# EAGLE design swbox_midi (EAGLE 6.3)

## Sheet 1 of 8
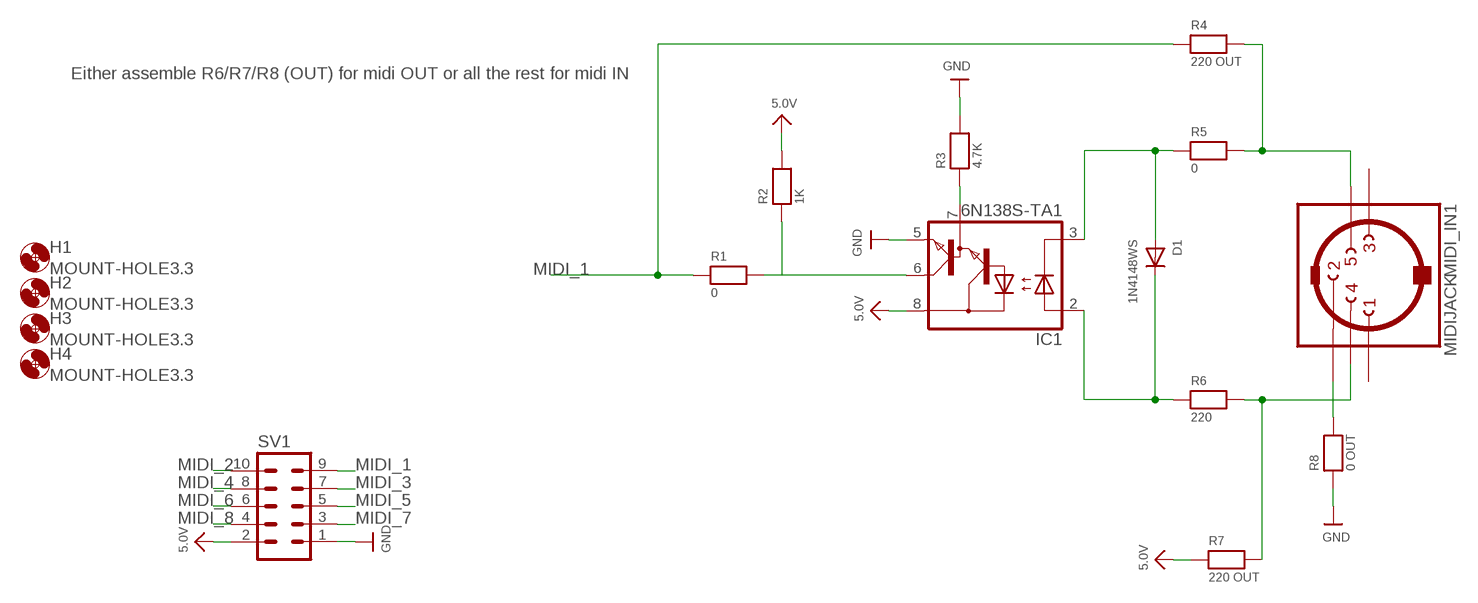
[diagram p0: schematic, sheet 1]

### Parts
D1  1N4148WS  DIODESOD-323  [SOD-323]
H1  MOUNT-HOLE3.3  [3,3]
H2  MOUNT-HOLE3.3  [3,3]
H3  MOUNT-HOLE3.3  [3,3]
H4  MOUNT-HOLE3.3  [3,3]
IC1  6N138S-TA1  6N138SMD  [SO8-GW300]
MIDI_IN1  MIDIJACK  [CP-2350]
R1  0  RESISTOR_0603  [_0603]
R2  1K  RESISTOR_0603  [_0603]
R3  4.7K  RESISTOR_0603  [_0603]
R4  220 OUT  RESISTOR_0603  [_0603]
R5  0  RESISTOR_0603  [_0603]
R6  220  RESISTOR_0603  [_0603]
R7  220 OUT  RESISTOR_0603  [_0603]
R8  0 OUT  RESISTOR_0603  [_0603]
SV1  ML10  [ML10]

### Nets
5.0V: IC1.8(VCC) R2.2 R7.1 SV1.2 ; also sheet 2,3,4,5,6,7,8
GND: IC1.5(GND) R3.2 R8.1 SV1.1 ; also sheet 2,3,4,5,6,7,8
MIDI_1: R1.1 R4.1 SV1.9
MIDI_2: SV1.10 ; also sheet 2
MIDI_3: SV1.7 ; also sheet 3
MIDI_4: SV1.8 ; also sheet 4
MIDI_5: SV1.5 ; also sheet 5
MIDI_6: SV1.6 ; also sheet 6
MIDI_7: SV1.3 ; also sheet 7
MIDI_8: SV1.4 ; also sheet 8
N$1: IC1.6(VO) R1.2 R2.1
N$3: MIDI_IN1.4 R6.2 R7.2
N$4: D1.C IC1.2(A) R6.1
N$5: D1.A IC1.3(C) R5.1
N$6: IC1.7(VB) R3.1
N$7: MIDI_IN1.5 R4.2 R5.2
N$8: MIDI_IN1.2 R8.2
Unconnected: MIDI_IN1.1 MIDI_IN1.3

### Notes on the sheet
- Either assemble R6/R7/R8 (OUT) for midi OUT or all the rest for midi IN

## Sheet 2 of 8
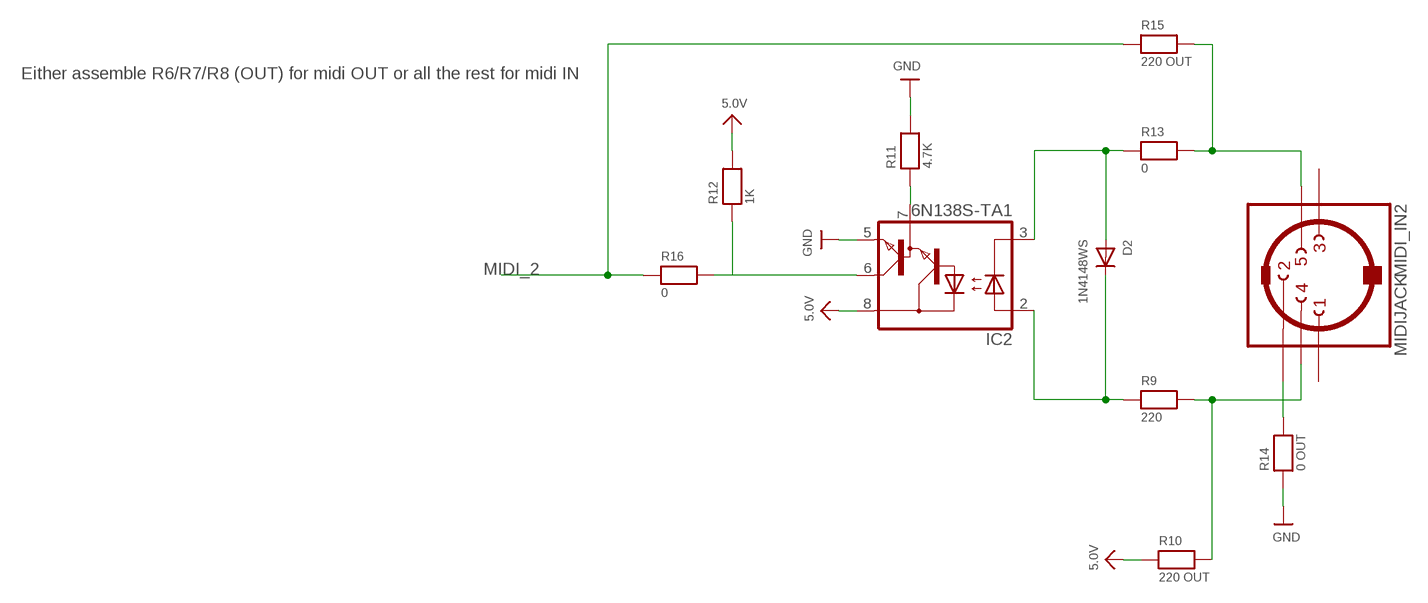
[diagram p1: schematic, sheet 2]

### Parts
D2  1N4148WS  DIODESOD-323  [SOD-323]
IC2  6N138S-TA1  6N138SMD  [SO8-GW300]
MIDI_IN2  MIDIJACK  [CP-2350]
R9  220  RESISTOR_0603  [_0603]
R10  220 OUT  RESISTOR_0603  [_0603]
R11  4.7K  RESISTOR_0603  [_0603]
R12  1K  RESISTOR_0603  [_0603]
R13  0  RESISTOR_0603  [_0603]
R14  0 OUT  RESISTOR_0603  [_0603]
R15  220 OUT  RESISTOR_0603  [_0603]
R16  0  RESISTOR_0603  [_0603]

### Nets
5.0V: IC2.8(VCC) R10.1 R12.2 ; also sheet 1,3,4,5,6,7,8
GND: IC2.5(GND) R11.2 R14.1 ; also sheet 1,3,4,5,6,7,8
MIDI_2: R15.1 R16.1 ; also sheet 1
N$2: MIDI_IN2.4 R9.2 R10.2
N$9: D2.C IC2.2(A) R9.1
N$10: D2.A IC2.3(C) R13.1
N$11: IC2.7(VB) R11.1
N$12: IC2.6(VO) R12.1 R16.2
N$13: MIDI_IN2.5 R13.2 R15.2
N$14: MIDI_IN2.2 R14.2
Unconnected: MIDI_IN2.1 MIDI_IN2.3

### Notes on the sheet
- Either assemble R6/R7/R8 (OUT) for midi OUT or all the rest for midi IN

## Sheet 3 of 8
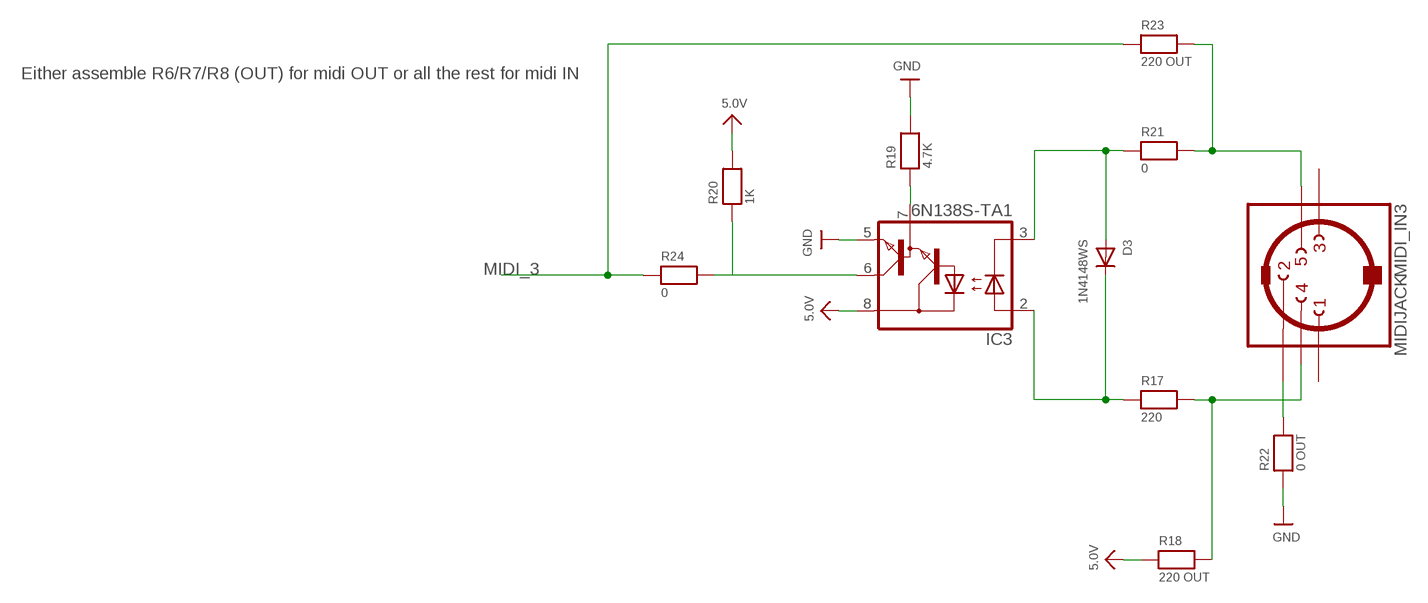
[diagram p2: schematic, sheet 3]

### Parts
D3  1N4148WS  DIODESOD-323  [SOD-323]
IC3  6N138S-TA1  6N138SMD  [SO8-GW300]
MIDI_IN3  MIDIJACK  [CP-2350]
R17  220  RESISTOR_0603  [_0603]
R18  220 OUT  RESISTOR_0603  [_0603]
R19  4.7K  RESISTOR_0603  [_0603]
R20  1K  RESISTOR_0603  [_0603]
R21  0  RESISTOR_0603  [_0603]
R22  0 OUT  RESISTOR_0603  [_0603]
R23  220 OUT  RESISTOR_0603  [_0603]
R24  0  RESISTOR_0603  [_0603]

### Nets
5.0V: IC3.8(VCC) R18.1 R20.2 ; also sheet 1,2,4,5,6,7,8
GND: IC3.5(GND) R19.2 R22.1 ; also sheet 1,2,4,5,6,7,8
MIDI_3: R23.1 R24.1 ; also sheet 1
N$15: MIDI_IN3.4 R17.2 R18.2
N$16: D3.C IC3.2(A) R17.1
N$17: D3.A IC3.3(C) R21.1
N$18: IC3.7(VB) R19.1
N$19: IC3.6(VO) R20.1 R24.2
N$20: MIDI_IN3.5 R21.2 R23.2
N$21: MIDI_IN3.2 R22.2
Unconnected: MIDI_IN3.1 MIDI_IN3.3

### Notes on the sheet
- Either assemble R6/R7/R8 (OUT) for midi OUT or all the rest for midi IN

## Sheet 4 of 8
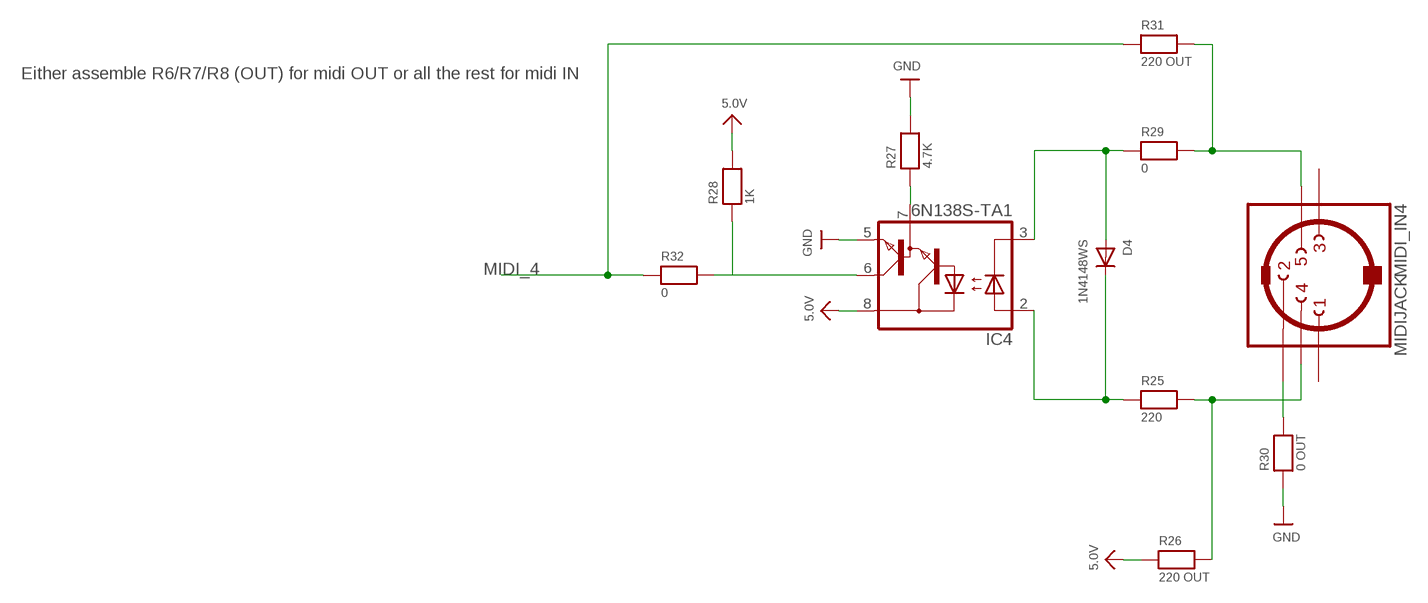
[diagram p3: schematic, sheet 4]

### Parts
D4  1N4148WS  DIODESOD-323  [SOD-323]
IC4  6N138S-TA1  6N138SMD  [SO8-GW300]
MIDI_IN4  MIDIJACK  [CP-2350]
R25  220  RESISTOR_0603  [_0603]
R26  220 OUT  RESISTOR_0603  [_0603]
R27  4.7K  RESISTOR_0603  [_0603]
R28  1K  RESISTOR_0603  [_0603]
R29  0  RESISTOR_0603  [_0603]
R30  0 OUT  RESISTOR_0603  [_0603]
R31  220 OUT  RESISTOR_0603  [_0603]
R32  0  RESISTOR_0603  [_0603]

### Nets
5.0V: IC4.8(VCC) R26.1 R28.2 ; also sheet 1,2,3,5,6,7,8
GND: IC4.5(GND) R27.2 R30.1 ; also sheet 1,2,3,5,6,7,8
MIDI_4: R31.1 R32.1 ; also sheet 1
N$22: MIDI_IN4.4 R25.2 R26.2
N$23: D4.C IC4.2(A) R25.1
N$24: D4.A IC4.3(C) R29.1
N$25: IC4.7(VB) R27.1
N$26: IC4.6(VO) R28.1 R32.2
N$27: MIDI_IN4.5 R29.2 R31.2
N$28: MIDI_IN4.2 R30.2
Unconnected: MIDI_IN4.1 MIDI_IN4.3

### Notes on the sheet
- Either assemble R6/R7/R8 (OUT) for midi OUT or all the rest for midi IN

## Sheet 5 of 8
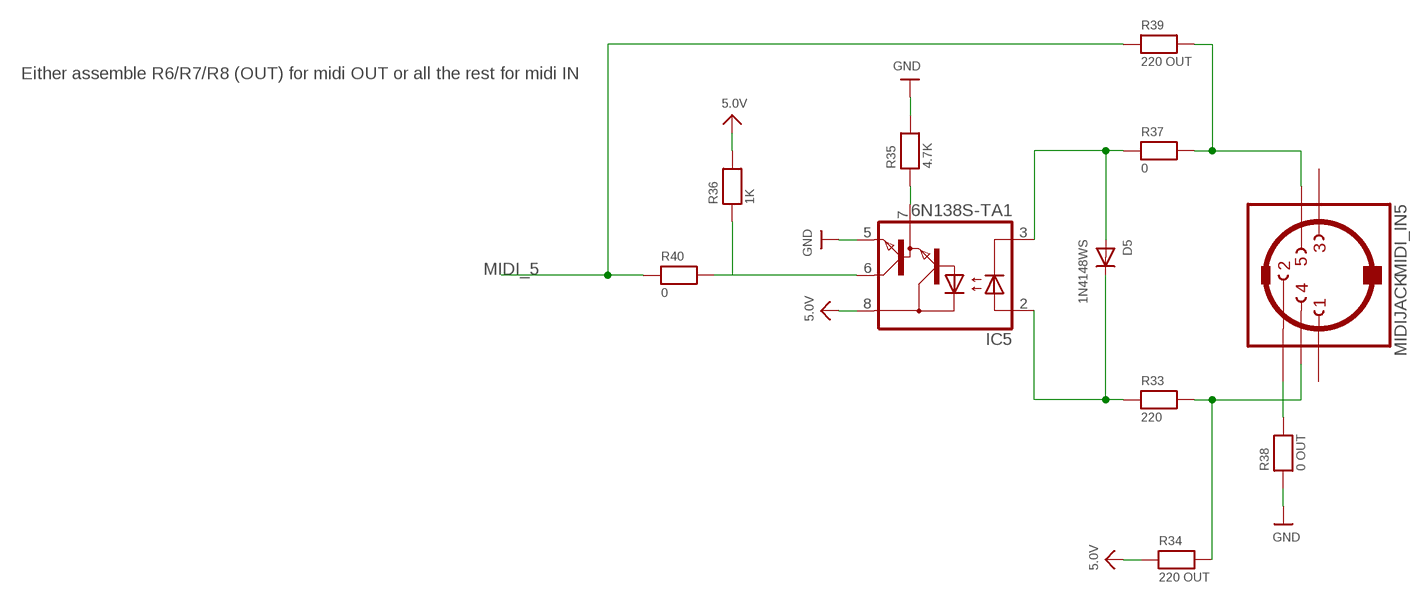
[diagram p4: schematic, sheet 5]

### Parts
D5  1N4148WS  DIODESOD-323  [SOD-323]
IC5  6N138S-TA1  6N138SMD  [SO8-GW300]
MIDI_IN5  MIDIJACK  [CP-2350]
R33  220  RESISTOR_0603  [_0603]
R34  220 OUT  RESISTOR_0603  [_0603]
R35  4.7K  RESISTOR_0603  [_0603]
R36  1K  RESISTOR_0603  [_0603]
R37  0  RESISTOR_0603  [_0603]
R38  0 OUT  RESISTOR_0603  [_0603]
R39  220 OUT  RESISTOR_0603  [_0603]
R40  0  RESISTOR_0603  [_0603]

### Nets
5.0V: IC5.8(VCC) R34.1 R36.2 ; also sheet 1,2,3,4,6,7,8
GND: IC5.5(GND) R35.2 R38.1 ; also sheet 1,2,3,4,6,7,8
MIDI_5: R39.1 R40.1 ; also sheet 1
N$29: MIDI_IN5.4 R33.2 R34.2
N$30: D5.C IC5.2(A) R33.1
N$31: D5.A IC5.3(C) R37.1
N$32: IC5.7(VB) R35.1
N$33: IC5.6(VO) R36.1 R40.2
N$34: MIDI_IN5.5 R37.2 R39.2
N$35: MIDI_IN5.2 R38.2
Unconnected: MIDI_IN5.1 MIDI_IN5.3

### Notes on the sheet
- Either assemble R6/R7/R8 (OUT) for midi OUT or all the rest for midi IN

## Sheet 6 of 8
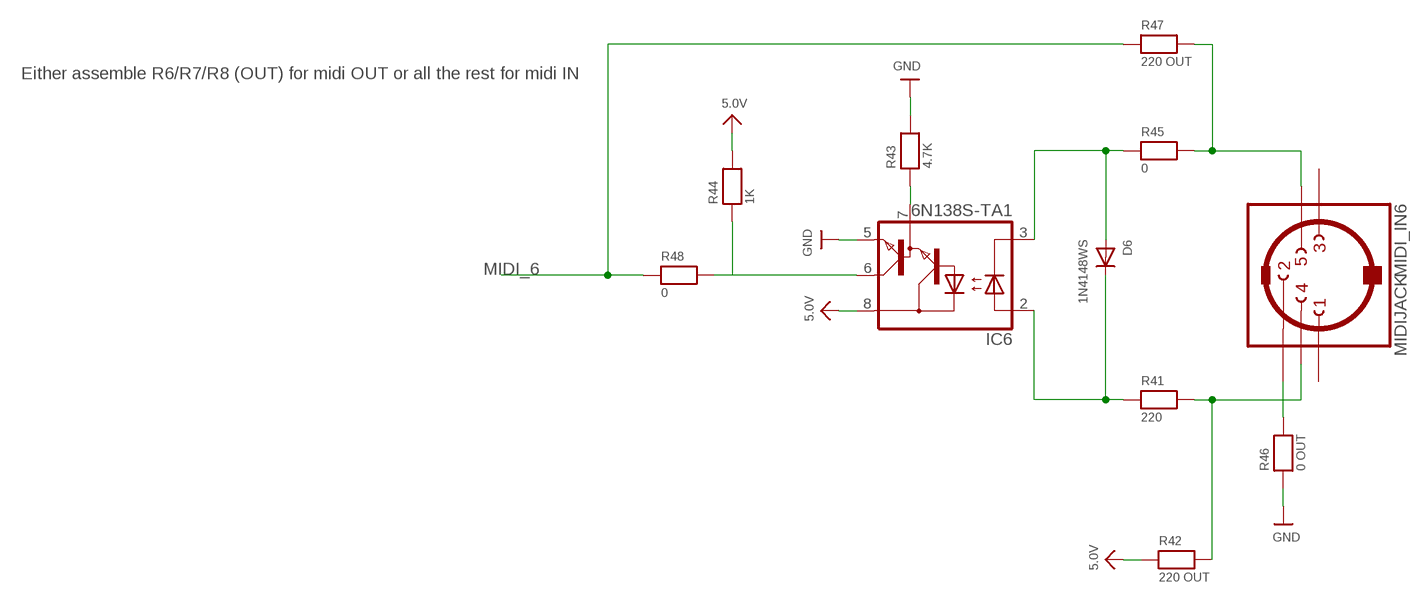
[diagram p5: schematic, sheet 6]

### Parts
D6  1N4148WS  DIODESOD-323  [SOD-323]
IC6  6N138S-TA1  6N138SMD  [SO8-GW300]
MIDI_IN6  MIDIJACK  [CP-2350]
R41  220  RESISTOR_0603  [_0603]
R42  220 OUT  RESISTOR_0603  [_0603]
R43  4.7K  RESISTOR_0603  [_0603]
R44  1K  RESISTOR_0603  [_0603]
R45  0  RESISTOR_0603  [_0603]
R46  0 OUT  RESISTOR_0603  [_0603]
R47  220 OUT  RESISTOR_0603  [_0603]
R48  0  RESISTOR_0603  [_0603]

### Nets
5.0V: IC6.8(VCC) R42.1 R44.2 ; also sheet 1,2,3,4,5,7,8
GND: IC6.5(GND) R43.2 R46.1 ; also sheet 1,2,3,4,5,7,8
MIDI_6: R47.1 R48.1 ; also sheet 1
N$36: MIDI_IN6.4 R41.2 R42.2
N$37: D6.C IC6.2(A) R41.1
N$38: D6.A IC6.3(C) R45.1
N$39: IC6.7(VB) R43.1
N$40: IC6.6(VO) R44.1 R48.2
N$41: MIDI_IN6.5 R45.2 R47.2
N$42: MIDI_IN6.2 R46.2
Unconnected: MIDI_IN6.1 MIDI_IN6.3

### Notes on the sheet
- Either assemble R6/R7/R8 (OUT) for midi OUT or all the rest for midi IN

## Sheet 7 of 8
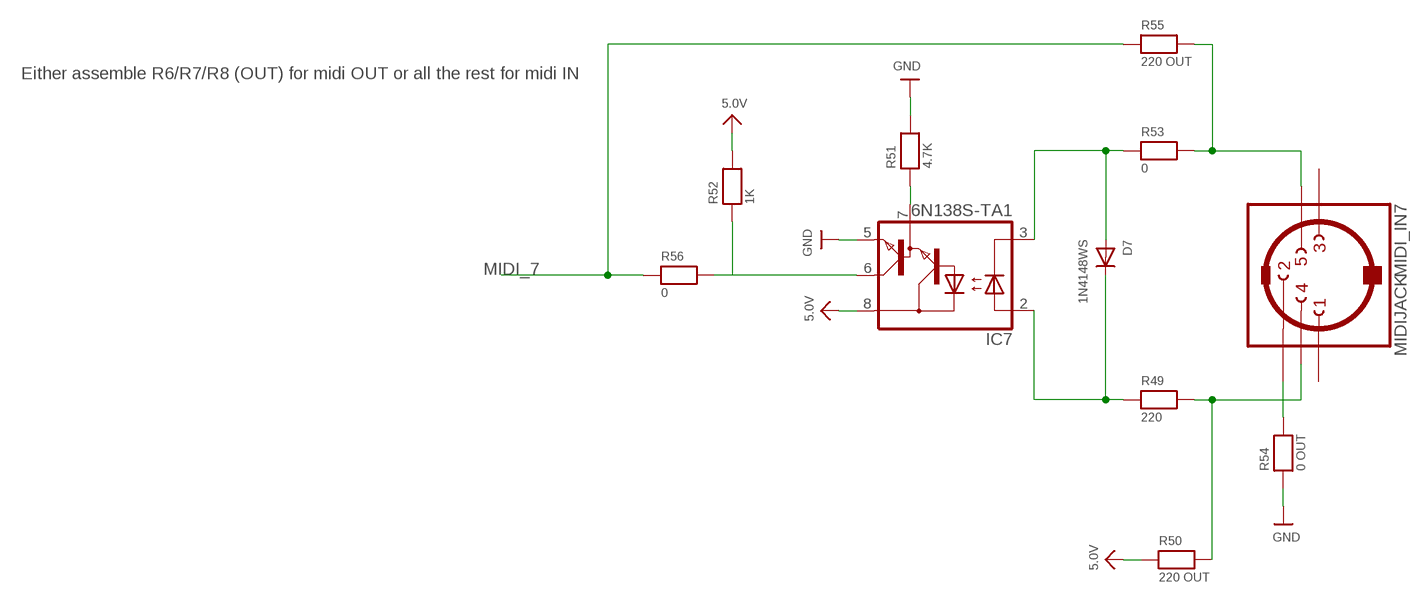
[diagram p6: schematic, sheet 7]

### Parts
D7  1N4148WS  DIODESOD-323  [SOD-323]
IC7  6N138S-TA1  6N138SMD  [SO8-GW300]
MIDI_IN7  MIDIJACK  [CP-2350]
R49  220  RESISTOR_0603  [_0603]
R50  220 OUT  RESISTOR_0603  [_0603]
R51  4.7K  RESISTOR_0603  [_0603]
R52  1K  RESISTOR_0603  [_0603]
R53  0  RESISTOR_0603  [_0603]
R54  0 OUT  RESISTOR_0603  [_0603]
R55  220 OUT  RESISTOR_0603  [_0603]
R56  0  RESISTOR_0603  [_0603]

### Nets
5.0V: IC7.8(VCC) R50.1 R52.2 ; also sheet 1,2,3,4,5,6,8
GND: IC7.5(GND) R51.2 R54.1 ; also sheet 1,2,3,4,5,6,8
MIDI_7: R55.1 R56.1 ; also sheet 1
N$43: MIDI_IN7.4 R49.2 R50.2
N$44: D7.C IC7.2(A) R49.1
N$45: D7.A IC7.3(C) R53.1
N$46: IC7.7(VB) R51.1
N$47: IC7.6(VO) R52.1 R56.2
N$48: MIDI_IN7.5 R53.2 R55.2
N$49: MIDI_IN7.2 R54.2
Unconnected: MIDI_IN7.1 MIDI_IN7.3

### Notes on the sheet
- Either assemble R6/R7/R8 (OUT) for midi OUT or all the rest for midi IN

## Sheet 8 of 8
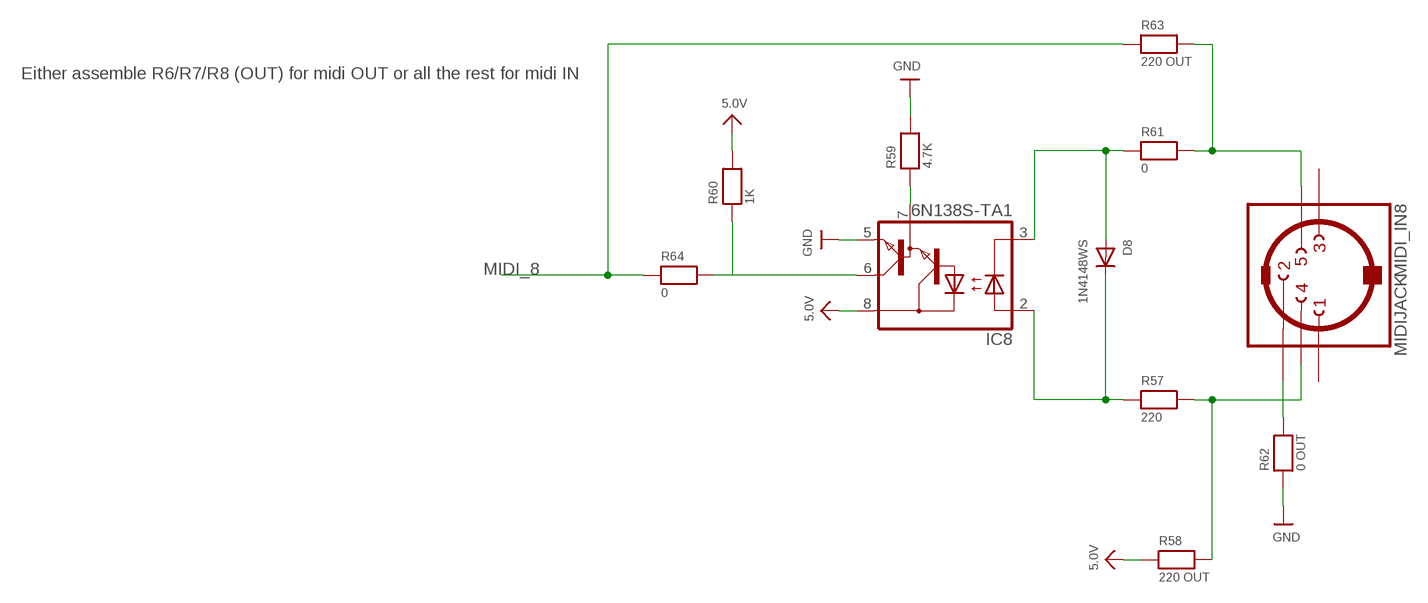
[diagram p7: schematic, sheet 8]

### Parts
D8  1N4148WS  DIODESOD-323  [SOD-323]
IC8  6N138S-TA1  6N138SMD  [SO8-GW300]
MIDI_IN8  MIDIJACK  [CP-2350]
R57  220  RESISTOR_0603  [_0603]
R58  220 OUT  RESISTOR_0603  [_0603]
R59  4.7K  RESISTOR_0603  [_0603]
R60  1K  RESISTOR_0603  [_0603]
R61  0  RESISTOR_0603  [_0603]
R62  0 OUT  RESISTOR_0603  [_0603]
R63  220 OUT  RESISTOR_0603  [_0603]
R64  0  RESISTOR_0603  [_0603]

### Nets
5.0V: IC8.8(VCC) R58.1 R60.2 ; also sheet 1,2,3,4,5,6,7
GND: IC8.5(GND) R59.2 R62.1 ; also sheet 1,2,3,4,5,6,7
MIDI_8: R63.1 R64.1 ; also sheet 1
N$50: MIDI_IN8.4 R57.2 R58.2
N$51: D8.C IC8.2(A) R57.1
N$52: D8.A IC8.3(C) R61.1
N$53: IC8.7(VB) R59.1
N$54: IC8.6(VO) R60.1 R64.2
N$55: MIDI_IN8.5 R61.2 R63.2
N$56: MIDI_IN8.2 R62.2
Unconnected: MIDI_IN8.1 MIDI_IN8.3

### Notes on the sheet
- Either assemble R6/R7/R8 (OUT) for midi OUT or all the rest for midi IN

## Library data of the parts
D1-D8 = microbuilder:DIODE: Diode SMA Model Volts Amps Type Vf Vr Digikey # Notes SSA34-E3 40V 3A Schottky 480mV @ 3A 200uA @ 40V SSA34-E3/61TGITR-ND CDBA120-G 20V 1A Schottky 500mV @ 1A 500uA @ 20V 641-1014-6-ND REEL MBRA210 10V 2A Schottky 350mV @ 2A 700uA @ 10V MBRA210LT3 SOD-123 Model Volts Amps Type Vf Vr Order # Notes BAT54T1G 30V 200mA Schottky 800mV @ 200mA 2uA @ 25V BAT54T1GOSTR-ND B0530W 30V 500mA Schottky 430mV @ 500mA 130uA @ 30V B0530W-FDICT-ND REEL MBR120 1A 20V Schottky 340mV @ 1A MBR120VLSFT1GOSCT-ND SOD-323 Model Volts Amps Type Vf Vr Order # Notes PMEG2005EJ 20V 500mA Schottky 355mV @ 500mA 568-4110-1-ND ZLLS410 10V 570mA Schottky 380mV @ 570mA ZLLS410CT-ND 1N4148WS 75V 150mA Silicon/Simple 1V 1N4148WSFSCT-ND REEL SOD-523 Model Volts Amps Type Vf Vr Order # Notes BAT54XV2 30V 200mA Schottky 0.8V @ 100mA BAT54XV2CT-ND TB751S 30V 30mA Schottky RB751S-40TE61CT-ND SOT23-R/W (R = Solder Paste/Reflow Ovens, W = Hand-Soldering) Model Volts Amps Type Vf Vr Order # Notes BAT54FILM 40V 300mA Schottky 497-7162-1-ND
H1-H4 = holes:MOUNT-HOLE: MOUNTING HOLE with drill center marker
IC1-IC8 = 6n138:6N138: MOTOROLA OPTO COUPLER
MIDI_IN1-MIDI_IN8 = keves:MIDIJACK: DIN 5 jack also known as MIDI jack A modification of conn-hirshman:MAB5SH with two options for the grounding 'teeth'
R1-R64 = microbuilder:RESISTOR: Resistors 0402 - 0402 Surface Mount Package 22 Ohm 1% 1/16W [Digikey: 311-22.0LRTR-ND] 33 Ohm 5% 1/16W 1.0K 5% 1/16W 1.5K 5% 1/16W 2.0K 1% 1/16W 10.0K 1% 1/16W [Digikey: 311-10.0KLRTR-ND] 10.0K 5% 1/16W [Digikey: RMCF0402JT10K0TR-ND] 12.1K 1% 1/16W [Digikey: 311-22.0LRTR-ND] 100.0K 5% 1/16W 0603 - 0603 Surface Mount Package 0 Ohm 1/10 Watt 1% Resistor 15 Ohm 1/10 Watt 1% Resistor 33 Ohm 1/10 Watt 1% Resistor 49.9 Ohm 1/10 Watt 1% Resistor 100 Ohm 1/10 Watt 1% Resistor 150 Ohm 1/10 Watt 1% Resistor 240 Ohm 1/10 Watt 1% Resistor 390 Ohm 1/10 Watt 1% Resistor 560 Ohm 1/10 Watt 1% Resistor 680 Ohm 1/10 Watt 1% Resistor 750 Ohm 1/10 Watt 1% Resistor 1.0K Ohm 1/10 Watt 1% Resistor 1.5K Ohm 1/10 Watt 1% Resistor 2.0K Ohm 1/10 Watt 1% Resistor 2.2K Ohm 1/10 Watt 1% Resistor 3.3K Ohm 1/10 Watt 1% Resistor 4.7K Ohm 1/10 Watt 1% Resistor 10.0K Ohm 1/10 Watt 1% Resistor 12.0K Ohm 1/10 Watt 1% Resistor 12.1K Ohm 1/10 Watt 1% Resistor 20.0K Ohm 1/10 Watt 1% Resistor 33.0K Ohm 1/10 Watt 1% Resistor 100.0K Ohm 1/10 Watt 1% Resistor 0805 - 0805 Surface Mount Package 0 Ohm 1/8 Watt 1% Resistor 33 Ohm 1/8 Watt 1% Resistor 100 Ohm 1/8 Watt 1% Resistor 150 Ohm 1/8 Watt 1% Resistor 200 Ohm 1/8 Watt 1% Resistor 240 Ohm 1/8 Watt 1% Resistor 330 Ohm 1/8 Watt 1% Resistor 390 Ohm 1/8 Watt 1% Resistor 470 Ohm 1/8 Watt 1% Resistor 1.0K Ohm 1/8 Watt 1% Resistor 1.5K Ohm 1/8 Watt 1% Resistor 2.0K Ohm 1/8 Watt 1% Resistor 4.7K Ohm 1/8 Watt 1% Resistor 5.1K Ohm 1/8 Watt 1% Resistor 5.6K Ohm 1/8 Watt 1% Resistor 10.0K Ohm 1/8 Watt 1% Resistor 22.0K Ohm 1/8 Watt 1% Resistor 33.0K Ohm 1/8 Watt 1% Resistor 100K Ohm 1/8 Watt 1% Resistor 1206 - 1206 Surface Mount Package 2012 - 2010 Surface Mount Package 0.11 Ohm 1/2 Watt 1% Resistor - Digikey: RHM.11UCT-ND
SV1 = con-harting-ml:ML10: HARTING; OC_FARNELL: unknown; OC_NEWARK: unknown

## Board
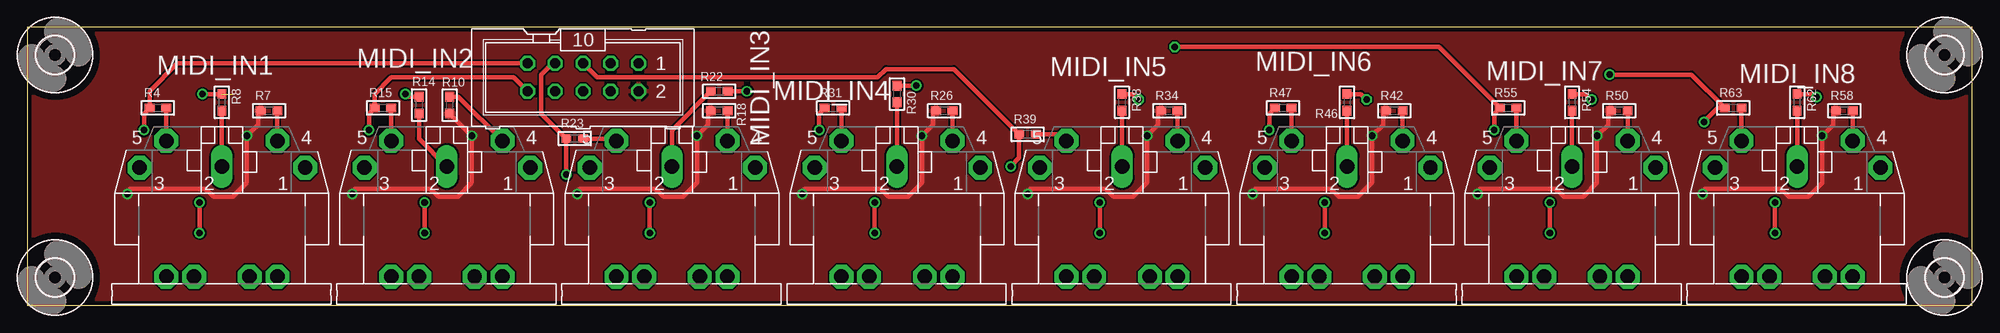
[diagram p8: board, top side]
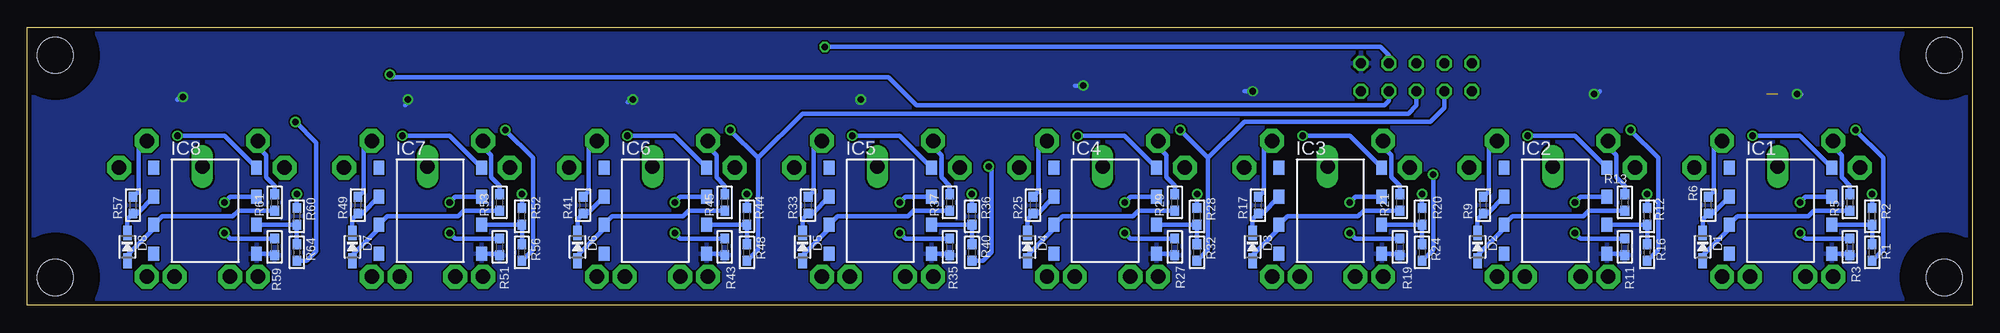
[diagram p9: board, bottom side, seen from below]

Size 177.8 x 25.4 mm. Coordinates in mm from the lower left corner, seen from the top.
Outline: 0,0 177.8,0 177.8,25.4 0,25.4 0,0
Copper layers (1*16): Top 0.0356mm / dielectric 1.5011mm / Bottom 0.0356mm
Design rules "oshpark_2layer *": minimum track width 6mil, minimum drill 13mil, track to track 6mil, track to pad 6mil, pad to pad 6mil, via to via 6mil, smd to smd 6mil, copper to edge 15mil, drill to drill 6mil, minimum pad ring 7mil, minimum via ring 7mil, stop-mask expansion 3mil, vias tented up to drill 0mil, thermal gap 10mil

### Footprints (pad centres in the part's own frame; a part is rotated, then mirrored left to right if it is on the bottom)
SOD-323 = smd 1.35 x 0.8: A 1.27,0; C -1.27,0
3,3 = hole 3.3: 0,0
SO8-GW300 = smd 1 x 1.27: 1 -4.69,3.937; 2 -4.69,1.27; 3 -4.69,-1.27; 4 -4.69,-3.937; 5 4.69,-3.937; 6 4.69,-1.27; 7 4.69,1.27; 8 4.69,3.937
CP-2350 = drill 1.321 pad 2.184 octagon: 1 7.62,12.58; 3 -7.52,12.58; 4 5.08,15.02; 5 -5.08,15.02; PE -2.54,2.62; PE1 -5.08,2.62; PE2 5.08,2.62; PE@ 2.54,2.62 | drill 1.321 long: 2 0,12.68
_0603 = smd 0.9 x 0.8: 1 -0.762,0; 2 0.762,0
ML10 = drill 0.914 octagon: 1 -5.08,-1.27; 2 -5.08,1.27; 3 -2.54,-1.27; 4 -2.54,1.27; 5 0,-1.27; 6 0,1.27; 7 2.54,-1.27; 8 2.54,1.27; 9 5.08,-1.27; 10 5.08,1.27

### Placement (x,y rotation side)
D1  24.64,5.33 270 bottom
D2  45.21,5.33 270 bottom
D3  65.79,5.33 270 bottom
D4  86.36,5.33 270 bottom
D5  106.93,5.33 270 bottom
D6  127.51,5.33 270 bottom
D7  148.08,5.33 270 bottom
D8  168.66,5.33 270 bottom
H1  2.54,2.54 0 top
H2  2.54,22.86 0 top
H3  175.26,2.54 0 top
H4  175.26,22.86 0 top
IC1  17.53,8.64 0 bottom
IC2  38.1,8.64 0 bottom
IC3  58.67,8.64 0 bottom
IC4  79.25,8.64 0 bottom
IC5  99.82,8.64 0 bottom
IC6  120.4,8.64 0 bottom
IC7  140.97,8.64 0 bottom
IC8  161.54,8.64 0 bottom
MIDI_IN1  17.78,0 0 top
MIDI_IN2  38.35,0 0 top
MIDI_IN3  58.93,0 0 top
MIDI_IN4  79.5,0 0 top
MIDI_IN5  100.08,0 0 top
MIDI_IN6  120.65,0 0 top
MIDI_IN7  141.22,0 0 top
MIDI_IN8  161.8,0 0 top
R1  9.14,4.83 90 bottom
R2  9.14,8.13 90 bottom
R3  11.18,5.33 270 bottom
R4  11.94,18.03 0 top
R5  11.18,9.4 90 bottom
R6  24.13,9.14 90 bottom
R7  22.1,17.78 0 top
R8  17.78,18.54 270 top
R9  44.7,9.14 90 bottom
R10  38.61,18.29 90 top
R11  31.75,5.33 270 bottom
R12  29.72,8.13 90 bottom
R13  31.75,9.4 90 bottom
R14  35.81,18.29 270 top
R15  32.51,18.03 0 top
R16  29.72,4.83 90 bottom
R17  65.28,9.14 90 bottom
R18  63.25,17.78 0 top
R19  52.32,5.33 270 bottom
R20  50.29,8.13 90 bottom
R21  52.32,9.4 90 bottom
R22  63.25,19.56 180 top
R23  50.04,15.24 0 top
R24  50.29,4.83 90 bottom
R25  85.85,9.14 90 bottom
R26  83.82,17.78 0 top
R27  72.9,5.33 270 bottom
R28  70.87,8.13 90 bottom
R29  72.9,9.4 90 bottom
R30  79.5,19.3 270 top
R31  73.66,18.03 0 top
R32  70.87,4.83 90 bottom
R33  106.43,9.14 90 bottom
R34  104.39,17.78 0 top
R35  93.47,5.33 270 bottom
R36  91.44,8.13 90 bottom
R37  93.47,9.4 90 bottom
R38  100.08,18.54 270 top
R39  91.44,15.62 0 top
R40  91.44,4.83 90 bottom
R41  127,9.14 90 bottom
R42  124.97,17.78 0 top
R43  114.05,5.33 270 bottom
R44  112.01,8.13 90 bottom
R45  114.05,9.4 90 bottom
R46  120.65,18.54 270 top
R47  114.81,18.03 0 top
R48  112.01,4.83 90 bottom
R49  147.57,9.14 90 bottom
R50  145.54,17.78 0 top
R51  134.62,5.33 270 bottom
R52  132.59,8.13 90 bottom
R53  134.62,9.4 90 bottom
R54  141.22,18.54 270 top
R55  135.38,18.03 0 top
R56  132.59,4.83 90 bottom
R57  168.15,9.14 90 bottom
R58  166.12,17.78 0 top
R59  155.19,5.33 270 bottom
R60  153.16,8.13 90 bottom
R61  155.19,9.4 90 bottom
R62  161.8,18.54 270 top
R63  155.96,18.03 0 top
R64  153.16,4.83 90 bottom
SV1  50.8,20.83 180 top

### Tracks (layer width: path | path; a pad name or v marks a point on that pad's centre or on a via)
5.0V  (via drill 0.6)
  Top 0.406: R7.1 21.08,17.78 21.08,16.51 v20.07,15.49 20.07,11.18 18.8,9.91 17.02,9.91 16.26,10.67 9.4,10.67 9.14,10.41 v9.14,10.16 | v29.72,10.16 29.72,10.41 29.97,10.67 36.83,10.67 37.59,9.91 39.37,9.91 40.64,11.18 v40.64,15.49 R10.1 | R18.1 62.23,17.78 62.23,16.51 v61.21,15.49 61.21,11.18 59.94,9.91 58.17,9.91 57.4,10.67 50.55,10.67 50.29,10.41 v50.29,10.16 | R26.1 82.8,17.78 82.8,16.51 v81.79,15.49 81.79,11.18 80.52,9.91 78.74,9.91 77.98,10.67 71.12,10.67 70.87,10.41 v70.87,10.16 | R34.1 103.38,17.78 103.38,16.51 v102.36,15.49 102.36,11.18 101.09,9.91 99.31,9.91 98.55,10.67 91.69,10.67 91.44,10.41 v91.44,10.16 | R42.1 123.95,17.78 123.95,16.51 v122.94,15.49 122.94,11.18 121.67,9.91 119.89,9.91 119.13,10.67 112.27,10.67 112.01,10.41 v112.01,10.16 | R50.1 144.53,17.78 144.53,16.51 v143.51,15.49 143.51,11.18 142.24,9.91 140.46,9.91 139.7,10.67 132.84,10.67 132.59,10.41 v132.59,10.16 | R58.1 165.1,17.78 165.1,16.51 v164.08,15.49 164.08,11.18 162.81,9.91 161.04,9.91 160.27,10.67 153.42,10.67 153.16,10.41 v153.16,10.16
  Bottom 0.406: v20.07,15.49 15.76,15.49 IC1.8 | R2.2 v9.14,10.16 | v40.64,15.49 36.33,15.49 IC2.8 | R12.2 v29.72,10.16 | v61.21,15.49 56.91,15.49 IC3.8 | R20.2 v50.29,10.16 | v81.79,15.49 77.48,15.49 IC4.8 | R28.2 v70.87,10.16 | v102.36,15.49 98.05,15.49 IC5.8 | R36.2 v91.44,10.16 | v122.94,15.49 118.63,15.49 IC6.8 | R44.2 v112.01,10.16 | v143.51,15.49 139.2,15.49 IC7.8 | R52.2 v132.59,10.16 | v164.08,15.49 159.78,15.49 IC8.8 | R60.2 v153.16,10.16
  pour Top: 0.51,0.51 0.51,24.89 177.29,24.89 177.29,0.51
GND  (via drill 0.6)  (1 unrouted)
  Top 0.406: R14.1 34.8,19.05 v34.54,19.3 | R22.1 v65.79,19.56 | R30.1 v81.28,20.07 | R38.1 101.09,19.3 v101.6,18.8 | R46.1 121.92,19.3 v122.43,18.8 | R54.1 142.49,19.3 v143,18.8 | R62.1 163.32,19.3 v163.58,19.05 | R8.1 v16,19.3
  Bottom 0.406: IC1.5 11.3,4.7 R3.2 | IC2.5 31.88,4.7 R11.2 | IC3.5 52.45,4.7 R19.2 | IC4.5 73.03,4.7 R27.2 | IC5.5 93.6,4.7 R35.2 | IC6.5 114.17,4.7 R43.2 | IC7.5 134.75,4.7 R51.2 | IC8.5 155.32,4.7 R59.2 | v16,19.3 15.62,19.3 | v34.54,19.3 34.29,19.3 34.04,19.56 | v65.79,19.56 66.55,19.56 | v81.28,20.07 82.04,20.07 | v101.6,18.8 101.85,18.54 | v122.43,18.8 122.68,18.8 122.94,18.54 | v143,18.8 143,18.54 143.26,18.29 | v163.58,19.05 163.83,19.05 164.08,18.8
  pour Bottom: 0.51,0.51 0.51,24.89 177.29,24.89 177.29,0.51
MIDI_1  (via drill 0.6)
  Top 0.406: v10.67,16 10.67,17.53 R4.1 11.18,19.56 13.72,22.1 SV1.9
  Bottom 0.406: R1.1 8.13,5.08 8.13,13.46 v10.67,16
MIDI_2  (via drill 0.6)
  Top 0.406: v31.24,16 31.24,17.53 R15.1 31.75,19.3 33.27,20.83 44.45,20.83 SV1.10
  Bottom 0.406: R16.1 28.7,5.08 28.7,13.46 v31.24,16
MIDI_3  (via drill 0.6)
  Top 0.406: v49.28,11.94 R23.1 46.99,17.53 46.99,21.08 48.01,22.1 SV1.7
  Bottom 0.406: R24.1 49.28,5.08 v49.28,11.94
MIDI_4  (via drill 0.6)
  Top 0.406: v72.39,16 72.39,17.53 R31.1
  Bottom 0.406: R32.1 69.85,5.08 69.85,13.46 | 69.85,13.46 v72.39,16 | 69.85,13.46 66.55,16.76 49.53,16.76 48.26,18.03 SV1.8
MIDI_5  (via drill 0.6)
  Top 0.406: SV1.5 52.07,20.83 77.72,20.83 78.49,21.59 84.71,21.59 R39.1 90.68,13.46 v89.92,12.7
  Bottom 0.406: R40.1 90.42,4.06 89.66,4.83 89.66,12.45 v89.92,12.7
MIDI_6  (via drill 0.6)
  Top 0.406: v113.54,16 113.54,17.53 R47.1
  Bottom 0.406: R48.1 111,5.08 111,13.46 | 111,13.46 v113.54,16 | SV1.6 50.8,18.29 51.56,17.53 106.93,17.53 111,13.46
MIDI_7  (via drill 0.6)
  Top 0.406: v134.11,16 134.11,17.53 R55.1 129.03,23.62 v104.9,23.62
  Bottom 0.406: R56.1 131.57,5.08 131.57,13.46 v134.11,16 | SV1.3 53.34,22.86 54.1,23.62 v104.9,23.62
MIDI_8  (via drill 0.6)
  Top 0.406: v144.65,21.08 152.15,21.08 R63.1 154.56,18.03 v153.29,16.76
  Bottom 0.406: SV1.4 53.34,18.67 53.72,18.29 96.52,18.29 99.06,20.83 144.4,20.83 v144.65,21.08 | R64.1 152.27,4.06 151.38,4.95 151.38,14.86 v153.29,16.76
N$1
  Bottom 0.406: R1.2 R2.1 IC1.6
N$2
  Top 0.406: R10.2 39.4,19.05 MIDI_IN2.4
  Bottom 0.406: R9.2 44.2,10.41 44.2,14.73 43.91,15.02 MIDI_IN2.4
N$3
  Top 0.406: MIDI_IN1.4 R7.2
  Bottom 0.406: R6.2 23.62,10.41 23.62,14.73 23.33,15.02 MIDI_IN1.4
N$4
  Bottom 0.406: IC1.2 23.74,8.38 R6.1 24.64,7.87 D1.C
N$5
  Bottom 0.406: R5.1 14.48,8.64 14.99,8.13 21.45,8.13 IC1.3 22.22,6.99 24.64,4.57 D1.A
N$6  (via drill 0.6)
  Top 0.406: v15.75,6.6 v15.75,9.4
  Bottom 0.406: R3.1 15.24,6.1 v15.75,6.6 | IC1.7 15.24,9.91 v15.75,9.4
N$7
  Top 0.406: MIDI_IN1.5 R4.2
  Bottom 0.406: R5.2 11.18,10.92 11.94,11.68 11.94,13.72 12.7,14.48 MIDI_IN1.5
N$8
  Top 0.406: R8.2 MIDI_IN1.2
N$9
  Bottom 0.406: IC2.2 44.31,8.38 R9.1 45.21,7.87 D2.C
N$10
  Bottom 0.406: R13.1 35.05,8.64 35.56,8.13 42.03,8.13 IC2.3 42.79,6.99 45.21,4.57 D2.A
N$11  (via drill 0.6)
  Top 0.406: v36.32,6.6 v36.32,9.4
  Bottom 0.406: R11.1 35.81,6.1 v36.32,6.6 | IC2.7 35.81,9.91 v36.32,9.4
N$12
  Bottom 0.406: R16.2 R12.1 IC2.6
N$13
  Top 0.406: MIDI_IN2.5 R15.2
  Bottom 0.406: R13.2 31.75,10.92 32.51,11.68 32.51,13.72 33.27,14.48 MIDI_IN2.5
N$14
  Top 0.406: R14.2 35.81,15.22 MIDI_IN2.2
N$15
  Top 0.406: MIDI_IN3.4 R18.2
  Bottom 0.406: R17.2 64.77,10.41 64.77,14.73 64.48,15.02 MIDI_IN3.4
N$16
  Bottom 0.406: IC3.2 64.89,8.38 R17.1 65.79,7.87 D3.C
N$17
  Bottom 0.406: R21.1 55.63,8.64 56.13,8.13 62.6,8.13 IC3.3 63.36,6.99 65.79,4.57 D3.A
N$18  (via drill 0.6)
  Top 0.406: v56.9,6.6 v56.9,9.4
  Bottom 0.406: R19.1 56.39,6.1 v56.9,6.6 | IC3.7 56.39,9.91 v56.9,9.4
N$19
  Bottom 0.406: R24.2 R20.1 IC3.6
N$20
  Top 0.406: R23.2 53.63,15.24 MIDI_IN3.5
  Bottom 0.406: R21.2 52.32,10.92 53.09,11.68 53.09,13.72 53.85,14.48 MIDI_IN3.5
N$21
  Top 0.406: MIDI_IN3.2 58.93,16 R22.2
N$22
  Top 0.406: MIDI_IN4.4 R26.2
  Bottom 0.406: R25.2 85.34,10.41 85.34,14.73 85.06,15.02 MIDI_IN4.4
N$23
  Bottom 0.406: IC4.2 85.46,8.38 R25.1 86.36,7.87 D4.C
N$24
  Bottom 0.406: R29.1 76.2,8.64 76.71,8.13 83.18,8.13 IC4.3 83.94,6.99 86.36,4.57 D4.A
N$25  (via drill 0.6)
  Top 0.406: v77.47,6.6 v77.47,9.4
  Bottom 0.406: R27.1 76.96,6.1 v77.47,6.6 | IC4.7 76.96,9.91 v77.47,9.4
N$26
  Bottom 0.406: R32.2 R28.1 IC4.6
N$27
  Top 0.406: MIDI_IN4.5 R31.2
  Bottom 0.406: R29.2 72.9,10.92 73.66,11.68 73.66,13.72 74.42,14.48 MIDI_IN4.5
N$28
  Top 0.406: R30.2 MIDI_IN4.2
N$29
  Top 0.406: MIDI_IN5.4 R34.2
  Bottom 0.406: R33.2 105.92,10.41 105.92,14.73 105.63,15.02 MIDI_IN5.4
N$30
  Bottom 0.406: IC5.2 106.04,8.38 R33.1 106.93,7.87 D5.C
N$31
  Bottom 0.406: R37.1 96.77,8.64 97.28,8.13 103.75,8.13 IC5.3 104.51,6.99 106.93,4.57 D5.A
N$32  (via drill 0.6)
  Top 0.406: v98.04,6.6 v98.04,9.4
  Bottom 0.406: R35.1 97.54,6.1 v98.04,6.6 | IC5.7 97.54,9.91 v98.04,9.4
N$33
  Bottom 0.406: R40.2 R36.1 IC5.6
N$34
  Top 0.406: R39.2 94.39,15.62 MIDI_IN5.5
  Bottom 0.406: R37.2 93.47,10.92 94.23,11.68 94.23,13.72 95,14.48 MIDI_IN5.5
N$35
  Top 0.406: R38.2 MIDI_IN5.2
N$36
  Top 0.406: MIDI_IN6.4 R42.2
  Bottom 0.406: R41.2 126.49,10.41 126.49,14.73 126.2,15.02 MIDI_IN6.4
N$37
  Bottom 0.406: IC6.2 126.61,8.38 R41.1 127.51,7.87 D6.C
N$38
  Bottom 0.406: R45.1 117.35,8.64 117.86,8.13 124.32,8.13 IC6.3 125.09,6.99 127.51,4.57 D6.A
N$39  (via drill 0.6)
  Top 0.406: v118.62,6.6 v118.62,9.4
  Bottom 0.406: R43.1 118.11,6.1 v118.62,6.6 | IC6.7 118.11,9.91 v118.62,9.4
N$40
  Bottom 0.406: R48.2 R44.1 IC6.6
N$41
  Top 0.406: MIDI_IN6.5 R47.2
  Bottom 0.406: R45.2 114.05,10.92 114.81,11.68 114.81,13.72 115.57,14.48 MIDI_IN6.5
N$42
  Top 0.406: R46.2 MIDI_IN6.2
N$43
  Top 0.406: MIDI_IN7.4 R50.2
  Bottom 0.406: R49.2 147.07,10.41 147.07,14.73 146.78,15.02 MIDI_IN7.4
N$44
  Bottom 0.406: IC7.2 147.18,8.38 R49.1 148.08,7.87 D7.C
N$45
  Bottom 0.406: R53.1 137.92,8.64 138.43,8.13 144.9,8.13 IC7.3 145.66,6.99 148.08,4.57 D7.A
N$46  (via drill 0.6)
  Top 0.406: v139.19,6.6 v139.19,9.4
  Bottom 0.406: R51.1 138.68,6.1 v139.19,6.6 | IC7.7 138.68,9.91 v139.19,9.4
N$47
  Bottom 0.406: R56.2 R52.1 IC7.6
N$48
  Top 0.406: MIDI_IN7.5 R55.2
  Bottom 0.406: R53.2 134.62,10.92 135.38,11.68 135.38,13.72 136.14,14.48 MIDI_IN7.5
N$49
  Top 0.406: R54.2 MIDI_IN7.2
N$50
  Top 0.406: MIDI_IN8.4 R58.2
  Bottom 0.406: R57.2 167.64,10.41 167.64,14.73 167.35,15.02 MIDI_IN8.4
N$51
  Bottom 0.406: IC8.2 167.76,8.38 R57.1 168.66,7.87 D8.C
N$52
  Bottom 0.406: R61.1 158.5,8.64 159,8.13 165.47,8.13 IC8.3 166.23,6.99 168.66,4.57 D8.A
N$53  (via drill 0.6)
  Top 0.406: v159.77,6.6 v159.77,9.4
  Bottom 0.406: R59.1 159.26,6.1 v159.77,6.6 | IC8.7 159.26,9.91 v159.77,9.4
N$54
  Bottom 0.406: R64.2 R60.1 IC8.6
N$55
  Top 0.406: MIDI_IN8.5 R63.2
  Bottom 0.406: R61.2 155.19,10.92 155.96,11.68 155.96,13.72 156.72,14.48 MIDI_IN8.5
N$56
  Top 0.406: R62.2 MIDI_IN8.2